# EAGLE design NodeEssential (EAGLE 4.16)
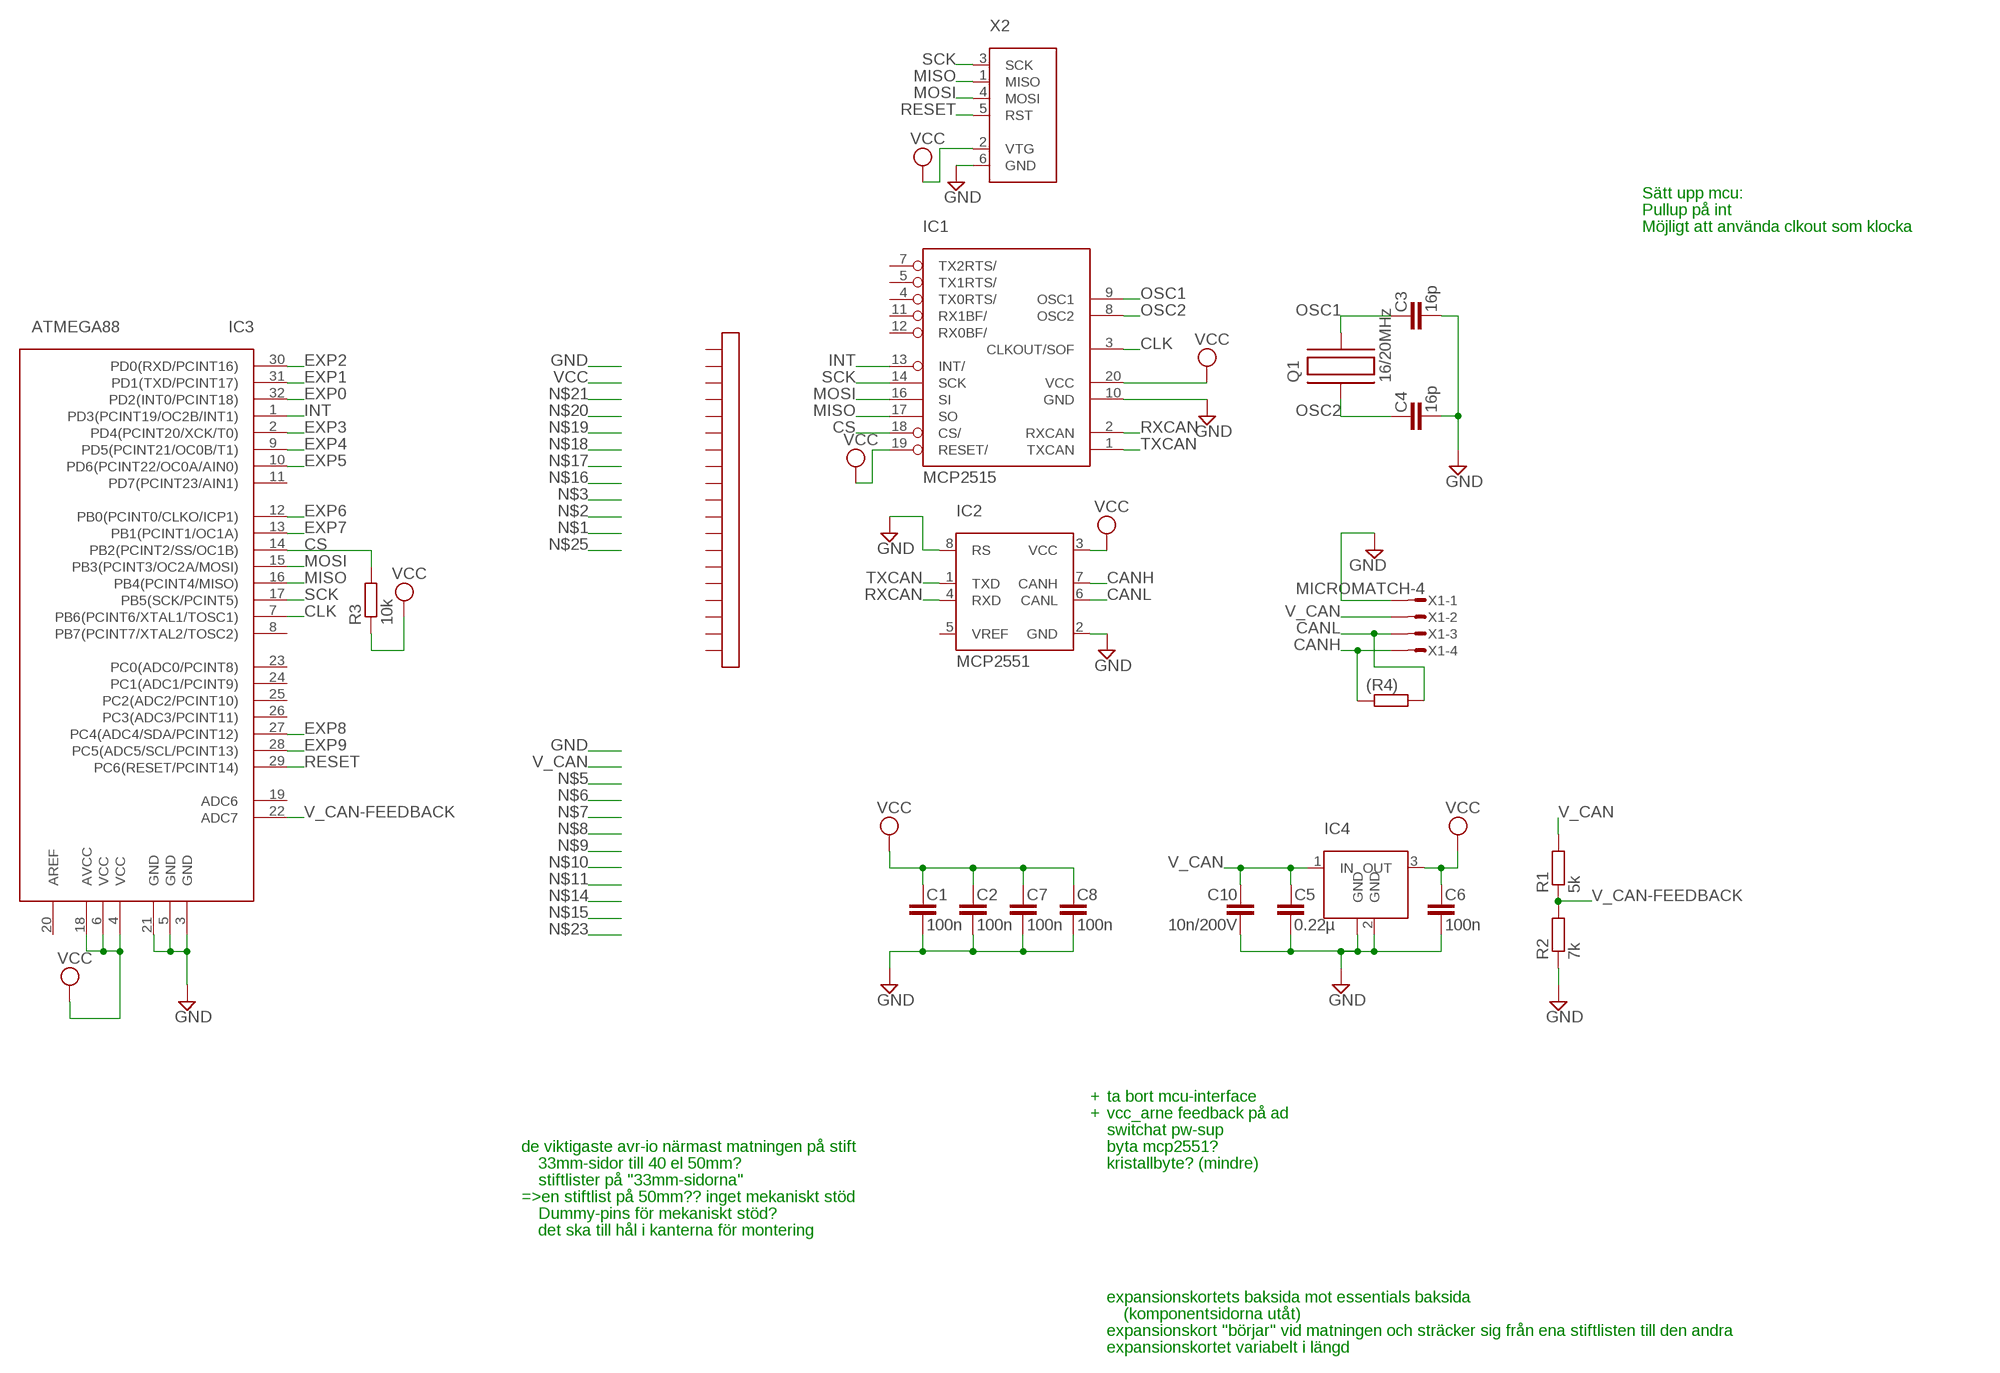
[diagram p0: schematic, sheet 1]

## Parts
(R4)  R-EUR0603  [R0603]
C1  100n  C-EU  [C0603]
C2  100n  C-EU  [C0603]
C3  16p  C-EU  [C0603]
C4  16p  C-EU  [C0603]
C5  0.22µ  C-EU  [C0603]
C6  100n  C-EU  [C0603]
C7  100n  C-EU  [C0603]
C8  100n  C-EU  [C0603]
C10  10n/200V  C-EU  [C0603]
IC1  MCP2515  [TSSOP]
IC2  MCP2551  [SOIC]
IC3  ATMEGA88  [TQFP32]
IC4  LM340MP-5.0  [SOT223]
Q1  16/20MHz  C-MAC-LFA147E  [SMD]
R1  5k  R-EUR0603  [R0603]
R2  7k  R-EUR0603  [R0603]
R3  10k  R-EUR0603  [R0603]
U$1  COLUMN19SIMPLE  [COLUMN19SIMPLE]
X1  MICROMATCH-4  [MICROMATCH-4]
X2  AVRISP6PIN  [6PIN]

## Nets
CANH: (R4).1 IC2.7(CANH) X1.4
CANL: (R4).2 IC2.6(CANL) X1.3
CLK: IC1.3(CLKOUT/SOF) IC3.7(PB6(PCINT6/XTAL1/TOSC1))
CS: IC1.18(CS/) IC3.14(PB2(PCINT2/SS/OC1B)) R3.2
EXP0: IC3.32(PD2(INT0/PCINT18))
EXP1: IC3.31(PD1(TXD/PCINT17))
EXP2: IC3.30(PD0(RXD/PCINT16))
EXP3: IC3.2(PD4(PCINT20/XCK/T0))
EXP4: IC3.9(PD5(PCINT21/OC0B/T1))
EXP5: IC3.10(PD6(PCINT22/OC0A/AIN0))
EXP6: IC3.12(PB0(PCINT0/CLKO/ICP1))
EXP7: IC3.13(PB1(PCINT1/OC1A))
EXP8: IC3.27(PC4(ADC4/SDA/PCINT12))
EXP9: IC3.28(PC5(ADC5/SCL/PCINT13))
GND: C1.2 C2.2 C3.2 C4.2 C5.2 C6.2 C7.2 C8.2 C10.2 IC1.10(GND) IC2.2(GND) IC2.8(RS) IC3.3(GND) IC3.5(GND) IC3.21(GND) IC4.2(GND) IC4.4(GND) R2.1 X1.1 X2.6(GND)
INT: IC1.13(INT/) IC3.1(PD3(PCINT19/OC2B/INT1))
MISO: IC1.17(SO) IC3.16(PB4(PCINT4/MISO)) X2.1(MISO)
MOSI: IC1.16(SI) IC3.15(PB3(PCINT3/OC2A/MOSI)) X2.4(MOSI)
OSC1: C3.1 IC1.9(OSC1) Q1.P$2
OSC2: C4.1 IC1.8(OSC2) Q1.P$1
RESET: IC3.29(PC6(RESET/PCINT14)) X2.5(RST)
RXCAN: IC1.2(RXCAN) IC2.4(RXD)
SCK: IC1.14(SCK) IC3.17(PB5(SCK/PCINT5)) X2.3(SCK)
TXCAN: IC1.1(TXCAN) IC2.1(TXD)
V_CAN: C5.1 C10.1 IC4.1(IN) R1.2 X1.2
V_CAN-FEEDBACK: IC3.22(ADC7) R1.1 R2.2
VCC: C1.1 C2.1 C6.1 C7.1 C8.1 IC1.19(RESET/) IC1.20(VCC) IC2.3(VCC) IC3.4(VCC) IC3.6(VCC) IC3.18(AVCC) IC4.3(OUT) R3.1 X2.2(VTG)
Unconnected: IC1.4(TX0RTS/) IC1.5(TX1RTS/) IC1.7(TX2RTS/) IC1.11(RX1BF/) IC1.12(RX0BF/) IC2.5(VREF) IC3.8(PB7(PCINT7/XTAL2/TOSC2)) IC3.11(PD7(PCINT23/AIN1)) IC3.19(ADC6) IC3.20(AREF) IC3.23(PC0(ADC0/PCINT8)) IC3.24(PC1(ADC1/PCINT9)) IC3.25(PC2(ADC2/PCINT10)) IC3.26(PC3(ADC3/PCINT11)) U$1.1 U$1.2 U$1.3 U$1.4 U$1.5 U$1.6 U$1.7 U$1.8 U$1.9 U$1.10 U$1.11 U$1.12 U$1.13 U$1.14 U$1.15 U$1.16 U$1.17 U$1.18 U$1.19

## Notes on the sheet
- Sätt upp mcu:
- Pullup på int
- Möjligt att använda clkout som klocka
- + | ta bort mcu-interface
- + | vcc_arne feedback på ad
- switchat pw-sup
- de viktigaste avr-io närmast matningen på stift | byta mcp2551?
- 33mm-sidor till 40 el 50mm? | kristallbyte? (mindre)
- stiftlister på "33mm-sidorna"
- =>en stiftlist på 50mm?? inget mekaniskt stöd
- Dummy-pins för mekaniskt stöd?
- det ska till hål i kanterna för montering
- expansionskortets baksida mot essentials baksida
- (komponentsidorna utåt)
- expansionskort "börjar" vid matningen och sträcker sig från ena stiftlisten till den andra
- expansionskortet variabelt i längd

## Library data of the parts
(R4) R1-R3 = rcl:R-EU
C1-C8 C10 = rcl:C-EU
IC1 = mcp2515:MCP2515
IC2 = mcp2551:MCP2551
IC3 = atmega88:ATMEGA88
IC4 = lm340mp:LM340MP-5.0
Q1 = hc49-4h-smx:C-MAC-LFA147E
U$1 = expboard:COLUMN19
X1 = con-amp-micromatch:MICROMATCH-4: MicroMaTch 4 7-215464-4 / 0-215464-4 Drawing Number C-215464 DDEController.pdf
X2 = avrisp:AVRISP6PIN

## Board
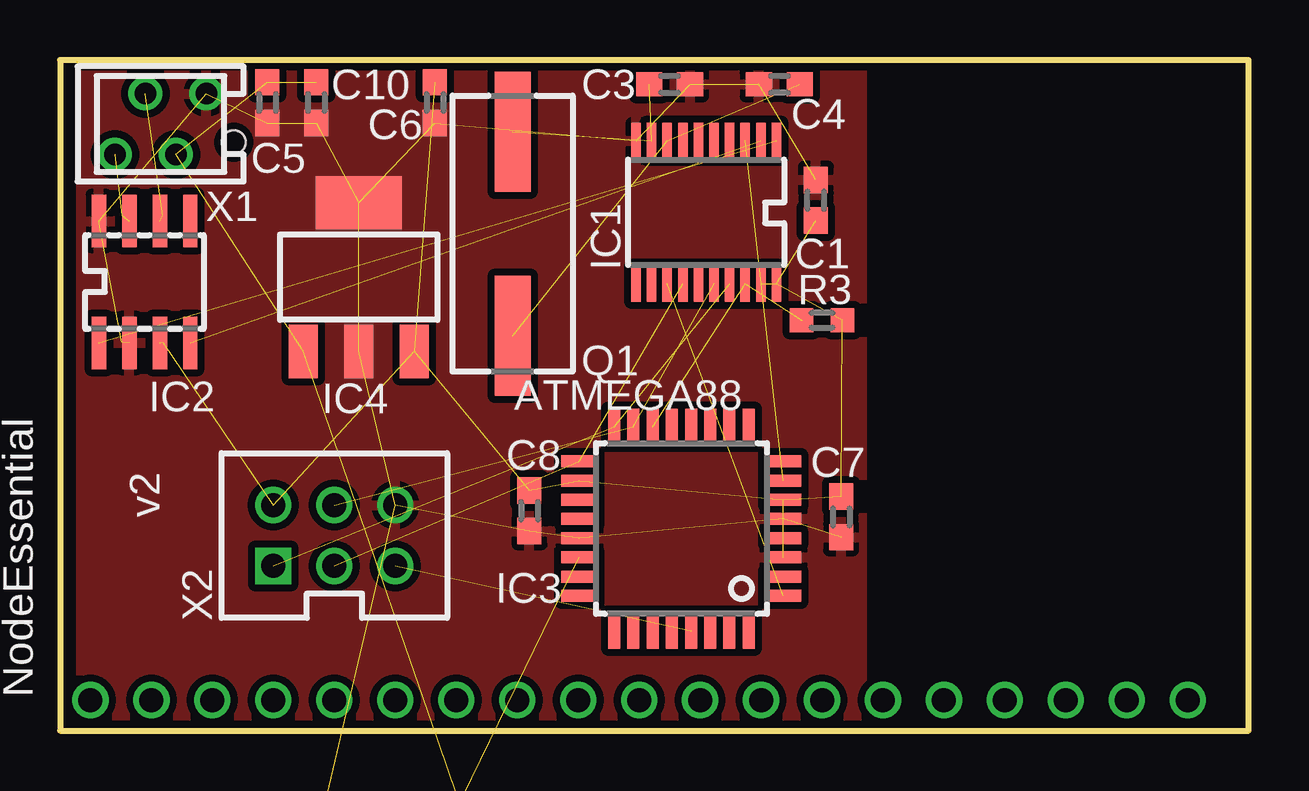
[diagram p1: board, top side]
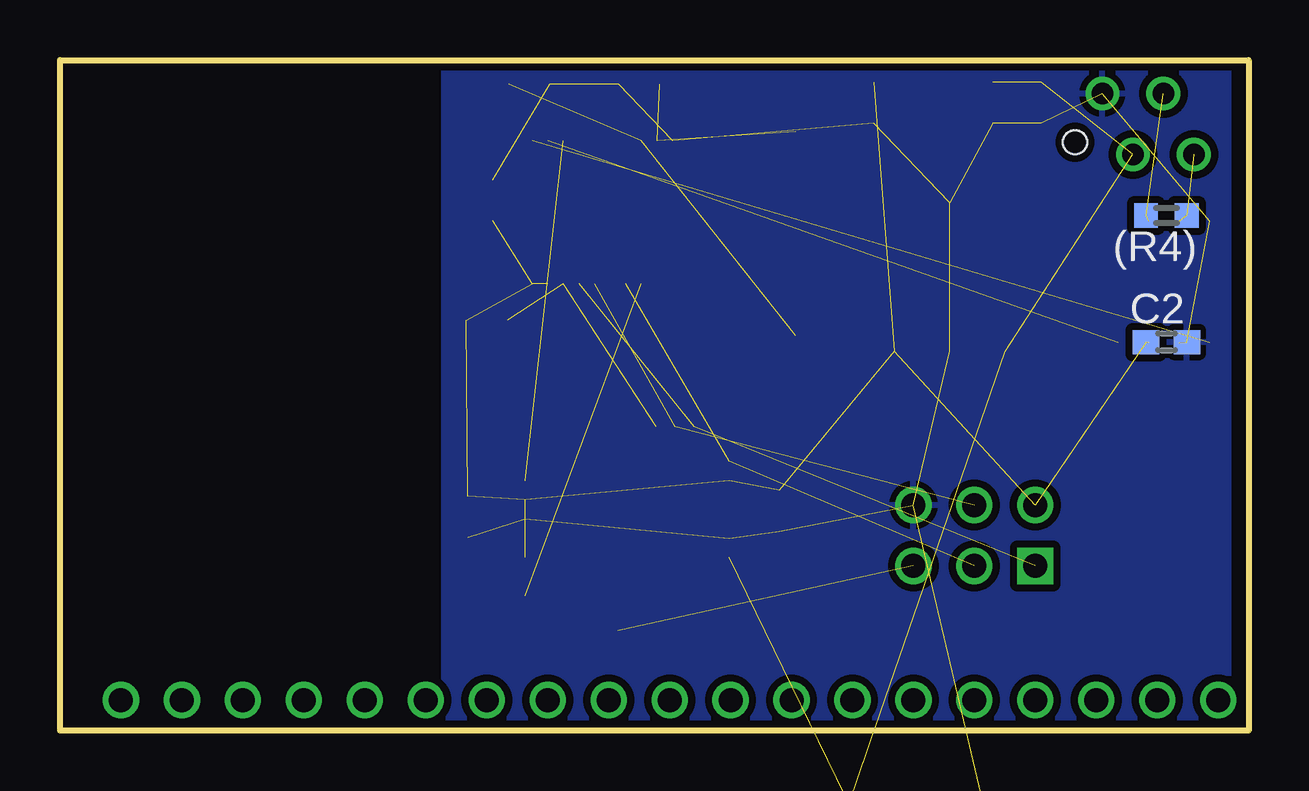
[diagram p2: board, bottom side, seen from below]

Size 49.53 x 27.94 mm. Coordinates in mm from the lower left corner, seen from the top.
Outline: 0,0 49.53,0 49.53,27.94 0,27.94 0,0
Copper layers (1*16): Top 0.035mm / dielectric 1.5mm / Bottom 0.035mm
Design rules "10mils, 0.6drill": minimum track width 10mil, minimum drill 0.6mm, track to track 10mil, track to pad 10mil, pad to pad 10mil, via to via 10mil, smd to smd 10mil, copper to edge 10mil, drill to drill 10mil, minimum pad ring 10mil, minimum via ring 8mil, stop-mask expansion 0mil, vias tented up to drill 0mil, thermal gap 10mil

### Footprints (pad centres in the part's own frame; a part is rotated, then mirrored left to right if it is on the bottom)
R0603 = smd 0.991 x 1.016: 1 -0.85,0; 2 0.85,0
C0603 = smd 1.1 x 1: 1 -0.85,0; 2 0.85,0
TSSOP = smd 0.396 x 1.5: 1 -2.925,-2.975; 2 -2.275,-2.975; 3 -1.625,-2.975; 4 -0.975,-2.975; 5 -0.325,-2.975; 6 0.325,-2.975; 7 0.975,-2.975; 8 1.625,-2.975; 9 2.275,-2.975; 10 2.925,-2.975; 11 2.925,2.975; 12 2.275,2.975; 13 1.625,2.975; 14 0.975,2.975; 15 0.325,2.975; 16 -0.325,2.975; 17 -0.975,2.975; 18 -1.625,2.975; 19 -2.275,2.975; 20 -2.925,2.975
SOIC = smd 0.6 x 2.2: 1 -1.905,-2.54; 2 -0.635,-2.54; 3 0.635,-2.54; 4 1.905,-2.54; 5 1.905,2.54; 6 0.635,2.54; 7 -0.635,2.54; 8 -1.905,2.54
TQFP32 = smd 1.5 x 0.5: 1 -4.25,2.65; 2 -4.25,1.85; 3 -4.25,1.05; 4 -4.25,0.25; 5 -4.25,-0.55; 6 -4.25,-1.35; 7 -4.25,-2.15; 8 -4.25,-2.95; 17 4.25,-2.95; 18 4.25,-2.15; 19 4.25,-1.35; 20 4.25,-0.55; 21 4.25,0.25; 22 4.25,1.05; 23 4.25,1.85; 24 4.25,2.65 | smd 0.5 x 1.5: 9 -2.8,-4.4; 10 -2,-4.4; 11 -1.2,-4.4; 12 -0.4,-4.4; 13 0.4,-4.4; 14 1.2,-4.4; 15 2,-4.4; 16 2.8,-4.4; 25 2.8,4.1; 26 2,4.1; 27 1.2,4.1; 28 0.4,4.1; 29 -0.4,4.1; 30 -1.2,4.1; 31 -2,4.1; 32 -2.8,4.1
SOT223 = smd 1.219 x 2.235: 1 -2.311,-3.099; 2 0,-3.099; 3 2.311,-3.099 | smd 3.6 x 2.2: 4 0,3.099
SMD = smd 5 x 1.5: P$1 4.25,0; P$2 -4.25,0
COLUMN19SIMPLE = drill 1 round: 1 0,22.86; 2 0,20.32; 3 0,17.78; 4 0,15.24; 5 0,12.7; 6 0,10.16; 7 0,7.62; 8 0,5.08; 9 0,2.54; 10 0,0; 11 0,-2.54; 12 0,-5.08; 13 0,-7.62; 14 0,-10.16; 15 0,-12.7; 16 0,-15.24; 17 0,-17.78; 18 0,-20.32; 19 0,-22.86
MICROMATCH-4 = drill 0.9 round: 1 1.905,1.27; 2 0.635,-1.27; 3 -0.635,1.27; 4 -1.905,-1.27 | hole 1: 3.048,-0.762
6PIN = drill 1 square: 1 -1.27,2.54 | drill 1 round: 2 1.27,2.54; 3 -1.27,0; 4 1.27,0; 5 -1.27,-2.54; 6 1.27,-2.54

### Placement (x,y rotation side)
(R4)  3.43,21.46 180 bottom
C1  31.5,22.1 90 top
C2  3.42,16.19 0 bottom
C3  25.4,26.92 0 top
C4  29.97,26.92 180 top
C5  8.64,26.16 270 top
C6  15.62,26.16 270 top
C7  32.55,8.91 270 top
C8  19.56,9.16 270 top
C10  10.67,26.16 270 top
IC1  26.93,21.59 180 top
IC2  3.52,18.69 0 top
IC3  25.89,8.27 180 top
IC4  12.45,18.89 0 top
Q1  18.86,20.71 270 top
R1  16.51,-5.08 0 top  (outside the outline)
R2  11.43,-5.08 0 top  (outside the outline)
R3  31.75,17.09 180 top
U$1  24.13,1.27 90 top
X1  4.19,25.27 0 top
X2  11.43,8.13 90 top

### Tracks (layer width: path | path; a pad name or v marks a point on that pad's centre or on a via)
CANH  (2 unrouted)
CANL  (2 unrouted)
CLK  (1 unrouted)
CS  (2 unrouted)
GND  (19 unrouted)
  pour Bottom (isolate 0.305): 0.84,27.86 33.55,27.86 33.55,-0.61 25.1,-0.62 0.84,-0.62
  pour Top (isolate 0.305, no thermals): 6.91,27.37 16.61,27.37 16.61,14.31 6.91,14.31
  pour Top (isolate 0.305): 0.89,27.81 33.4,27.81 33.4,-0.51 0.89,-0.51
INT  (1 unrouted)
MISO  (2 unrouted)
MOSI  (2 unrouted)
OSC1  (2 unrouted)
OSC2  (2 unrouted)
RESET  (1 unrouted)
RXCAN  (1 unrouted)
SCK  (2 unrouted)
TXCAN  (1 unrouted)
V_CAN  (4 unrouted)
V_CAN-FEEDBACK  (2 unrouted)
VCC  (13 unrouted)

### Text on the board
tPlace: 5 | 6 | 7 | 4 | v2 | 3 | 8 | 9 | 2 | 1 | 0 | GND | VCC | NodeEssential